# Altium project Debug Pinborad.PrjPCB
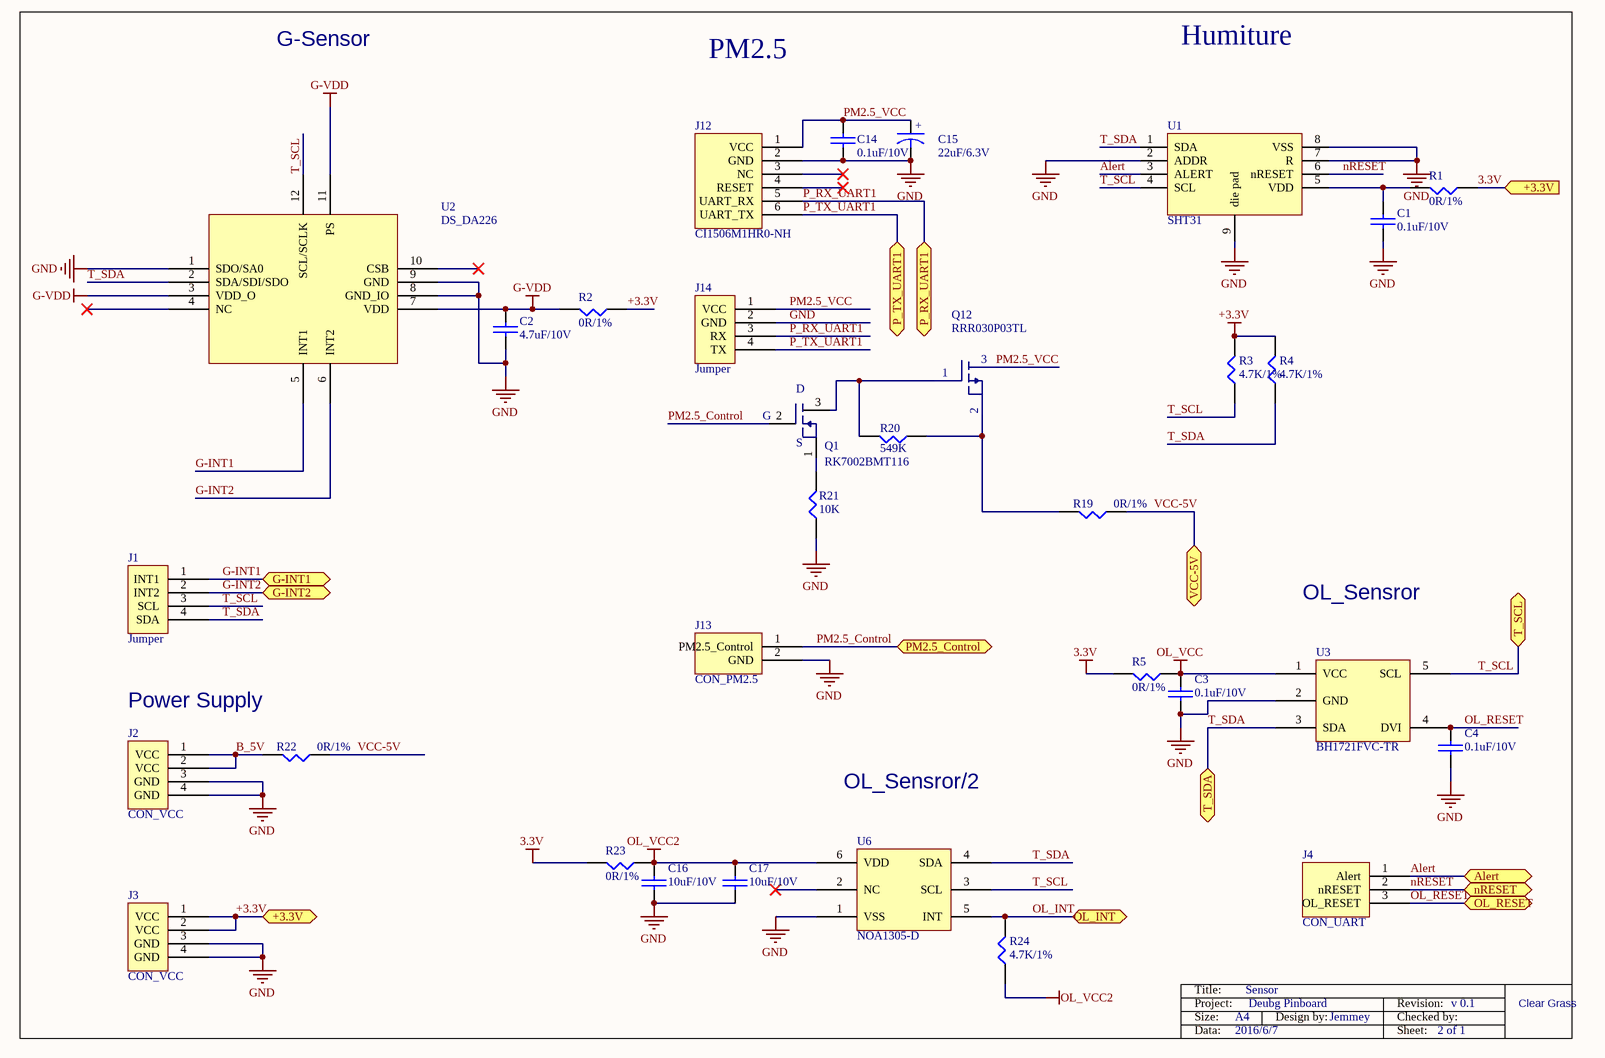
[diagram p0: Sensor.SchDoc]
2 sheets, 68 parts. Net scope: flat (ports and power ports of the same name join across sheets).
Board file: PCB1.PcbDoc
Sheets:
  Sensor.SchDoc
  LCD_RGB.SchDoc

## Sheet Sensor.SchDoc: main_assy PCB
size A4

### Parts
C1  0.1uF/10V  [0402C]
C2  4.7uF/10V  [0402C]
C3  0.1uF/10V  [0402C]
C4  0.1uF/10V  [0402C]
C14  0.1uF/10V  [0402C]
C15  22uF/6.3V  [3216]
C16  10uF/10V  [0603C]
C17  10uF/10V  [0603C]
J1  Jumper  [2.54*4]
J2  CON_VCC  [2.54*4]
J3  CON_VCC  [2.54*4]
J4  CON_UART  [2.54*3]
J12  CI1506M1HR0-NH  [WTB_SIDE_6PIN]
J13  CON_PM2.5  [2.54*2]
J14  Jumper  [2.54*4]
Q1  RK7002BMT116  [SOT23]
Q12  RRR030P03TL  [TSMT3]
R1  0R/1%  [0603R]
R2  0R/1%  [0603R]
R3  4.7K/1%  [0402R]
R4  4.7K/1%  [0402R]
R5  0R/1%  [0603R]
R19  0R/1%  [0603R]
R20  549K  [0402R]
R21  10K  [0402R]
R22  0R/1%  [0603R]
R23  0R/1%  [0603R]
R24  4.7K/1%  [0402R]
U1  SHT31  [DFN]
U2  DS_DA226  [LGA-12]
U3  BH1721FVC-TR  [WSOF5]
U6  NOA1305-D  [CUDFN6]

### Ports
+3.3V, +3.3V (in), Alert, G-INT1, G-INT2, nRESET, OL_INT, OL_RESET, P_RX_UART1, P_TX_UART1, PM2.5_Control, T_SCL, T_SDA, VCC-5V

### Nets
+3.3V: J3.1(VCC) J3.2(VCC) R1.1 R2.1 R3.2 R4.2 R5.2 R23.2 ; port +3.3V  [also labelled 3.3V]
G-VDD: C2.1 R2.2 U2.3(VDD_O) U2.7(VDD) U2.11(PS)
GND: C1.2 C2.2 C3.2 C4.2 C14.2 C15.2 C16.2 C17.2 J2.3(GND) J2.4(GND) J3.3(GND) J3.4(GND) J12.2(GND) J13.2(GND) J14.2(GND) R21.1 U1.2(ADDR) U1.7(R) U1.8(VSS) U1.9(die_pad) U2.1(SDO/SA0) U2.8(GND_IO) U2.9(GND) U3.2(GND) U6.1(VSS)
OL_VCC: C3.1 R5.1 U3.1(VCC)
OL_VCC2: C16.1 C17.1 R23.1 R24.1 U6.6(VDD)
Alert: J4.1(Alert) U1.3(ALERT) ; port Alert
B_5V: J2.1(VCC) J2.2(VCC) R22.2
G-INT1: J1.1(INT1) U2.5(INT1) ; port G-INT1
G-INT2: J1.2(INT2) U2.6(INT2) ; port G-INT2
nRESET: J4.2(nRESET) U1.6(nRESET) ; port nRESET
OL_INT: R24.2 U6.5(INT) ; port OL_INT
OL_RESET: C4.1 J4.3(OL_RESET) U3.4(DVI) ; port OL_RESET
P_RX_UART1: J12.5(UART_RX) J14.3(RX) ; port P_RX_UART1
P_TX_UART1: J12.6(UART_TX) J14.4(TX) ; port P_TX_UART1
PM2.5_Control: J13.1(PM2.5_Control) Q1.2(G) ; port PM2.5_Control
PM2.5_VCC: C14.1 C15.1 J12.1(VCC) J14.1(VCC) Q12.3(D)
T_SCL: J1.3(SCL) R3.1 U1.4(SCL) U2.12(SCL/SCLK) U3.5(SCL) U6.3(SCL) ; port T_SCL
T_SDA: J1.4(SDA) R4.1 U1.1(SDA) U2.2(SDA/SDI/SDO) U3.3(SDA) U6.4(SDA) ; port T_SDA
VCC-5V: R19.1 R22.1 ; port VCC-5V
NetC1_1: C1.1 R1.2 U1.5(VDD)
NetQ1_1: Q1.1(S) R21.2
NetQ1_3: Q1.3(D) Q12.1(G) R20.2
NetQ12_2: Q12.2(S) R19.2 R20.1

Not connected (* = marked no-connect by the designer): J12 3(NC)* 4(RESET)*; U2 4(NC)* 10(CSB)*; U6 2(NC)*

### Notes on the sheet
- G-Sensor
- Humiture
- PM2.5
- OL_Sensror
- Power Supply
- OL_Sensror/2
- Title:
- Sensor
- Project:
- Size:
- Data:
- A4
- 2016/6/7
- Deubg Pinboard
- Design by:
- Jemmey
- Revision:
- Sheet:
- Checked by:
- 2 of 1
- v 0.1
- Clear Grass
- (in symbol Cap) +

### Library data of the parts
C1 C2 = CAP: 厂家：Murata，型号：GRM155R71A104KA01D
C3 C4 C14 C16 C17 = CAP: 厂家：Murata，型号：
C15 = Cap: 厂家：ROHM，型号：TAJC227K010RNJ
J1 = Jumper*4
J12 = CI15: 厂家：瀚荃股份，型号：CI1506M1HR0-NH
J14 = Jumper*4*PM25
Q1 = RK7002: 厂家：ROHM，型号：RK7002BMT116
Q12 = PMOS: 厂家：ROHM，型号：RRR030P03TL
R1-R5 R23 R24 = RES1: 厂家：Yageo，型号：RC0402FR-0710KL
R19 R22 = RES1: 厂家：Yageo，型号：RC0402FR-070RL
R20 R21 = RES1
U1 = SHT31: 厂家：盛思睿，型号：SHT31
U2 = LI: 厂家：ST，型号：LIS2DH12

## Sheet LCD_RGB.SchDoc: main_assy PCB
size A4
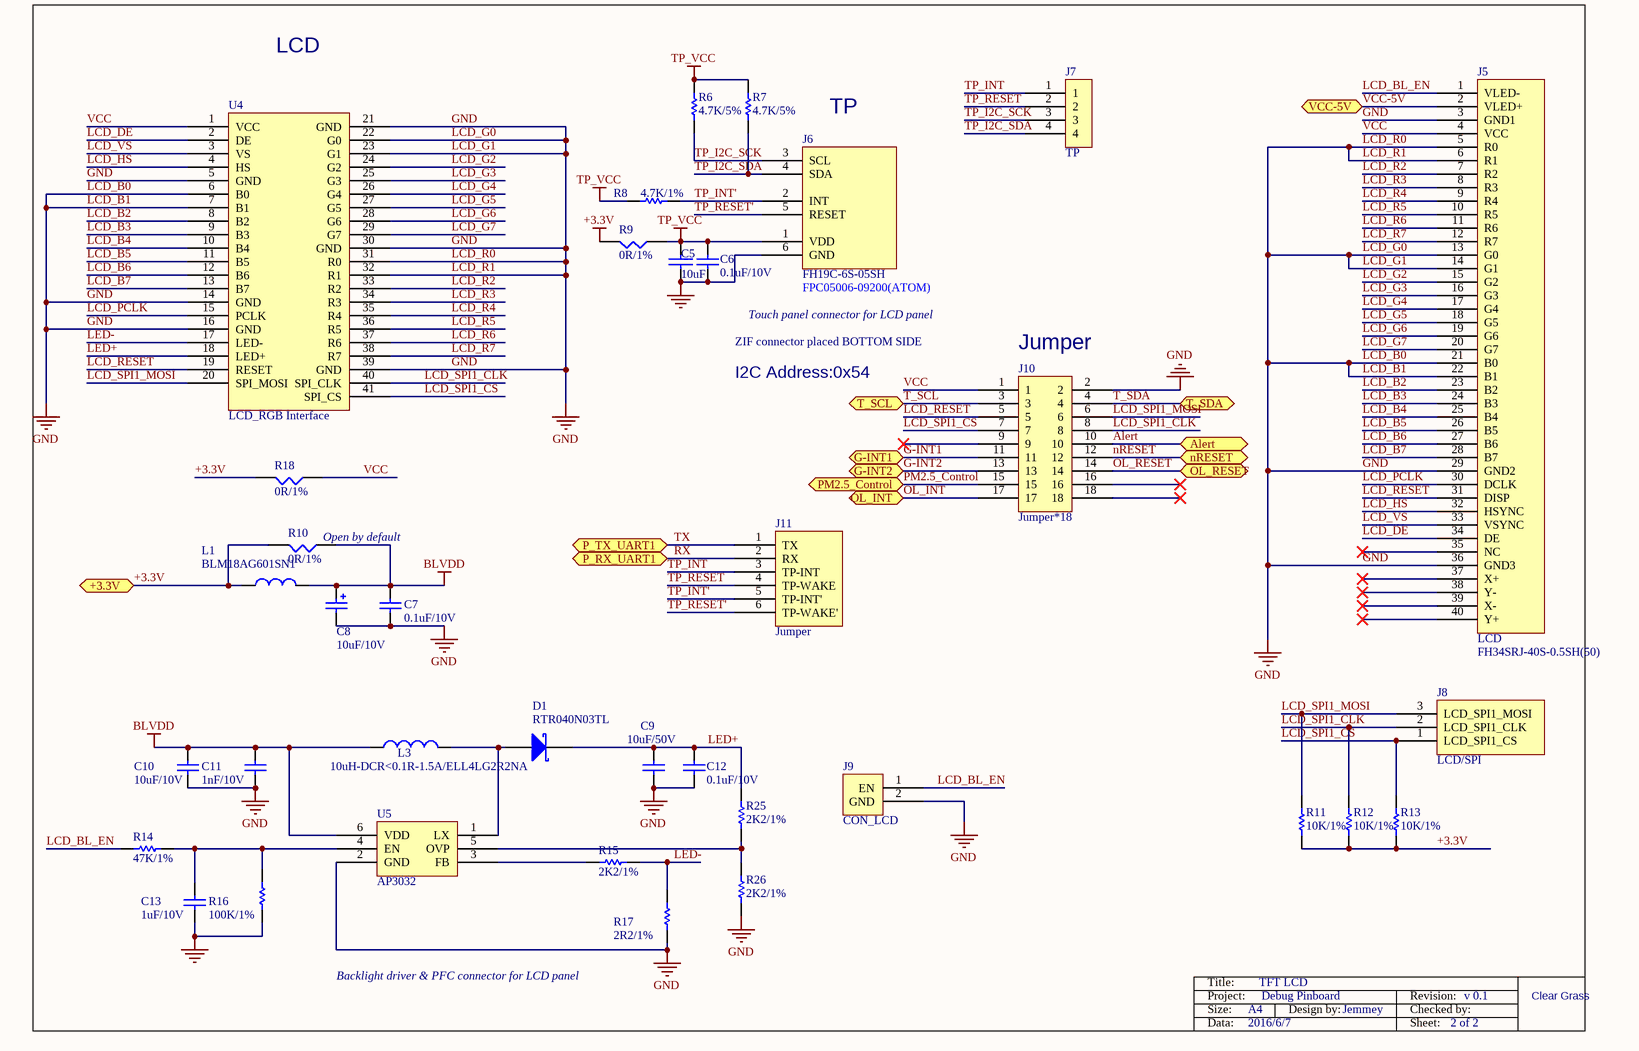
[diagram p1: LCD_RGB.SchDoc]

### Parts
C5  10uF  [0603C]
C6  0.1uF/10V  [0402C]
C7  0.1uF/10V  [0402C]
C8  10uF/10V  [0603C]
C9  10uF/50V  [0603C]
C10  10uF/10V  [0603C]
C11  1nF/10V  [0402C]
C12  0.1uF/10V  [0402C]
C13  1uF/10V  [0402C]
D1  RTR040N03TL  [TUMD2M]
J5  LCD  [FPC_CON40-BACK-IRS]
J6  FH19C-6S-05SH  [FPC_CON6-BACK-MOLEX]
J7  TP  [FPC_CON4-1MM-MOLEX]
J8  LCD/SPI  [2.54*3]
J9  CON_LCD  [2.54*2]
J10  Jumper*18  [2.54*18]
J11  Jumper  [2.54*2 *3]
L1  BLM18AG601SN1  [0603R]
L3  10uH-DCR<0.1R-1.5A/ELL4LG2R2NA  [INDM4040X18N]
R6  4.7K/5%  [0402R]
R7  4.7K/5%  [0402R]
R8  4.7K/1%  [0402R]
R9  0R/1%  [0603R]
R10  0R/1%  [0603R]
R11  10K/1%  [0402R]
R12  10K/1%  [0402R]
R13  10K/1%  [0402R]
R14  47K/1%  [0402R]
R15  2K2/1%  [0402R]
R16  100K/1%  [0402R]
R17  2R2/1%  [0402R]
R18  0R/1%  [0603R]
R25  2K2/1%  [0402R]
R26  2K2/1%  [0402R]
U4  LCD_RGB Interface  [FPC_CON41-0.3MM-HRS]
U5  AP3032  [SOT23-6-L]

### Ports
+3.3V, Alert, G-INT1, G-INT2, nRESET, OL_INT, OL_RESET, P_RX_UART1, P_TX_UART1, PM2.5_Control, T_SCL, T_SDA, VCC-5V

### Nets
+3.3V: L1.1 R9.2 R10.2 R11.1 R12.1 R13.1 R18.2 ; port +3.3V
BLVDD: C7.1 C8.1 C10.2 C11.2 L1.2 L3.1 R10.1 U5.6(VDD)
GND: C5.1 C6.1 C7.2 C8.2 C9.2 C10.1 C11.1 C12.1 C13.1 J5.3(GND1) J5.5(R0) J5.6(R1) J5.13(G0) J5.14(G1) J5.21(B0) J5.22(B1) J5.29(GND2) J5.36(GND3) J6.6(GND) J9.2(GND) J10.2 R16.2 R17.2 R26.1 U4.5(GND) U4.6(B0) U4.7(B1) U4.14(GND) U4.16(GND) U4.21(GND) U4.22(G0) U4.23(G1) U4.30(GND) U4.31(R0) U4.32(R1) U4.39(GND) U5.2(GND)  [also labelled LCD_B0, LCD_B1, LCD_G0, LCD_G1, LCD_R0, LCD_R1]
TP_VCC: C5.2 C6.2 J6.1(VDD) R6.2 R7.2 R8.1 R9.1
Alert: J10.10 ; port Alert
G-INT1: J10.11 ; port G-INT1
G-INT2: J10.13 ; port G-INT2
LCD_B2: J5.23(B2) U4.8(B2)
LCD_B3: J5.24(B3) U4.9(B3)
LCD_B4: J5.25(B4) U4.10(B4)
LCD_B5: J5.26(B5) U4.11(B5)
LCD_B6: J5.27(B6) U4.12(B6)
LCD_B7: J5.28(B7) U4.13(B7)
LCD_BL_EN: J5.1(VLED-) J9.1(EN) R14.1
LCD_DE: J5.34(DE) U4.2(DE)
LCD_G2: J5.15(G2) U4.24(G2)
LCD_G3: J5.16(G3) U4.25(G3)
LCD_G4: J5.17(G4) U4.26(G4)
LCD_G5: J5.18(G5) U4.27(G5)
LCD_G6: J5.19(G6) U4.28(G6)
LCD_G7: J5.20(G7) U4.29(G7)
LCD_HS: J5.32(HSYNC) U4.4(HS)
LCD_PCLK: J5.30(DCLK) U4.15(PCLK)
LCD_R2: J5.7(R2) U4.33(R2)
LCD_R3: J5.8(R3) U4.34(R3)
LCD_R4: J5.9(R4) U4.35(R4)
LCD_R5: J5.10(R5) U4.36(R5)
LCD_R6: J5.11(R6) U4.37(R6)
LCD_R7: J5.12(R7) U4.38(R7)
LCD_RESET: J5.31(DISP) J10.5 U4.19(RESET)
LCD_SPI1_CLK: J8.2(LCD_SPI1_CLK) J10.8 R12.2 U4.40(SPI_CLK)
LCD_SPI1_CS: J8.1(LCD_SPI1_CS) J10.7 R13.2 U4.41(SPI_CS)
LCD_SPI1_MOSI: J8.3(LCD_SPI1_MOSI) J10.6 R11.2 U4.20(SPI_MOSI)
LCD_VS: J5.33(VSYNC) U4.3(VS)
LED+: C9.1 C12.2 D1.2(K) R25.2 U4.18(LED+)
LED-: R15.2 R17.1 U4.17(LED-)
nRESET: J10.12 ; port nRESET
OL_INT: J10.17 ; port OL_INT
OL_RESET: J10.14 ; port OL_RESET
PM2.5_Control: J10.15 ; port PM2.5_Control
RX: J11.2(RX) ; port P_RX_UART1  [project net P_RX_UART1]
T_SCL: J10.3 ; port T_SCL
T_SDA: J10.4 ; port T_SDA
TP_I2C_SCK: J6.3(SCL) J7.3 R6.1
TP_I2C_SDA: J6.4(SDA) J7.4 R7.1
TP_INT: J7.1 J11.3(TP-INT)
TP_INT': J6.2(INT) J11.5(TP-INT') R8.2
TP_RESET: J7.2 J11.4(TP-WAKE)
TP_RESET': J6.5(RESET) J11.6(TP-WAKE')
TX: J11.1(TX) ; port P_TX_UART1  [project net P_TX_UART1]
VCC: J5.4(VCC) J10.1 R18.1 U4.1(VCC)
VCC-5V: J5.2(VLED+) ; port VCC-5V
NetC13_2: C13.2 R14.2 R16.1 U5.4(EN)
NetD1_1: D1.1(A) L3.2 U5.1(LX)
NetR15_1: R15.1 U5.3(FB)
NetR25_1: R25.1 R26.2 U5.5(OVP)

Not connected (* = marked no-connect by the designer): J5 35(NC)* 37(X+)* 38(Y-)* 39(X-)* 40(Y+)*; J10 9* 16* 18*

### Notes on the sheet
- LCD
- (near J6) TP
- (near J6) FPC05006-09200(ATOM)
- I2C Address:0x54
- ZIF connector placed BOTTOM SIDE
- Touch panel connector for LCD panel
- (near J10) Jumper
- (near R10) Open by default
- (near J5) FH34SRJ-40S-0.5SH(50)
- Backlight driver & PFC connector for LCD panel
- Title:
- TFT LCD
- Project:
- Size:
- Data:
- A4
- 2016/6/7
- Debug Pinboard
- Design by:
- Jemmey
- Revision:
- Sheet:
- Checked by:
- 2 of 2
- v 0.1
- Clear Grass

### Library data of the parts
C5 = CAP: 厂家：Murata，型号：GRM1555C1H120JA01D
C6 C10 C11 C13 = CAP: Capacitor; Value: 100pF; Ordered by: Subcon; Published: 8-Jun-2000; Revision: July-2002: Re-released for DXP Platform.; Publisher: Altium Limited
C7 = Cap: Capacitor; Value: 10nF; Ordered by: Subcon; Published: 8-Jun-2000; Revision: July-2002: Re-released for DXP Platform.; Publisher: Altium Limited
C8 = Cap Pol1: Polarized Capacitor (Radial); Value: 10uF; Ordered by: Subcon; Published: 8-Jun-2000; Revision: July-2002: Re-released for DXP Platform.; Publisher: Altium Limited
C9 C12 = CAP: 厂家：Murata，型号：; Value: 100pF; Ordered by: Subcon; Published: 8-Jun-2000; Revision: July-2002: Re-released for DXP Platform.; Publisher: Altium Limited
D1 = D Schottky: Schottky Diode; Manuf_Part_1: STPS1L40M; Code - JEDEC: DO-214-AA; Ordered by: ST; Ref St: 9151085; ECCN_US/EU: EAR99/NEC; Published: 8-Jun-2000; Revision: July-2002: Re-released for DXP Platform.; Publisher: Altium Limited; Manuf_1: ST
J5 = FPC60_1
J6 = FH19C-6S-05SH: ZIF connector placed bottom side; Manuf_1: ATOM; Manuf_2: Hirose; Manuf_Part_1: FPC05006-09200; Ordered by: Subcon; Silkscreen: TS; Manuf_Part_2: FH19C-6S-05SH
J7 = Jumper_uart: Jumper
J8 = Jumper
J11 = Jumper_uart
L1 = CHOKE: 厂家：MURATA，型号：BLM18AG601SN1
L3 = Inductor: Value: 100uH; Ordered by: Subcon; Published: 8-Jun-2000; Revision: July-2002: Re-released for DXP Platform.; Publisher: Altium Limited
R6-R8 R11-R13 = Res1: 厂家：Yageo，型号：; Value: 1K; Ordered by: Subcon; Published: 8-Jun-2000; Revision: July-2002: Re-released for DXP Platform.; Publisher: Altium Limited
R9 R10 R18 = RES1: 厂家：Yageo，型号：RC0402FR-070RL
R14-R17 R25 R26 = Res1: Resistor; Value: 1K; Ordered by: Subcon; Published: 8-Jun-2000; Revision: July-2002: Re-released for DXP Platform.; Publisher: Altium Limited
U5 = AP3032: Manuf_Part_1: STLD40DPUR; Ordered by: ST; Ref St: 9176009; ECCN_US/EU: EAR99/NEC; Manuf_1: ST

## Nets that join several sheets
+3.3V: Sensor (8 pins), LCD_RGB (7 pins)
GND: Sensor (25 pins), LCD_RGB (37 pins)
Alert: Sensor (J4.1 U1.3), LCD_RGB (J10.10)
G-INT1: Sensor (J1.1 U2.5), LCD_RGB (J10.11)
G-INT2: Sensor (J1.2 U2.6), LCD_RGB (J10.13)
nRESET: Sensor (J4.2 U1.6), LCD_RGB (J10.12)
OL_INT: Sensor (R24.2 U6.5), LCD_RGB (J10.17)
OL_RESET: Sensor (C4.1 J4.3 U3.4), LCD_RGB (J10.14)
P_RX_UART1: Sensor (J12.5 J14.3), LCD_RGB (J11.2)
P_TX_UART1: Sensor (J12.6 J14.4), LCD_RGB (J11.1)
PM2.5_Control: Sensor (J13.1 Q1.2), LCD_RGB (J10.15)
T_SCL: Sensor (6 pins), LCD_RGB (J10.3)
T_SDA: Sensor (6 pins), LCD_RGB (J10.4)
VCC-5V: Sensor (R19.1 R22.1), LCD_RGB (J5.2)